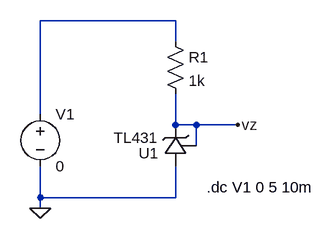
[diagram p0: schematic TL431_test.asc]
TL431_test.asc, the LTspice schematic file:
Version 4
SHEET 1 880 680
WIRE 16 16 -192 16
WIRE 16 48 16 16
WIRE -192 160 -192 16
WIRE 16 176 16 128
WIRE 48 176 16 176
WIRE 112 176 48 176
WIRE 48 208 48 176
WIRE -192 288 -192 240
WIRE 16 288 16 240
WIRE 16 288 -192 288
WIRE -192 304 -192 288
FLAG 112 176 vz
FLAG -192 304 0
SYMBOL TL431 32 240 R180
SYMATTR InstName U1
SYMBOL voltage -192 144 R0
WINDOW 123 0 0 Left 0
WINDOW 39 0 0 Left 0
SYMATTR InstName V1
SYMATTR Value 0
SYMBOL res 0 32 R0
SYMATTR InstName R1
SYMATTR Value 1k
TEXT 64 272 Left 2 !.dc V1 0 5 10m

The netlist it stands for:
* TL431_test.asc
XU1 0 vz vz TL431  ; pins A K ref
V1 N001 0 0
R1 N001 vz 1k
.dc V1 0 5 10m
.lib TL431.mod
.backanno
.end